# Altium schematic sheet Display_LED_Monitor.SchDoc: Display LED Monitor
size Tabloid; Date: 05/10/2023; Engineer: Terry D. Schevker; Revision: 1.0; SheetNumber: 2; SheetTotal: 2
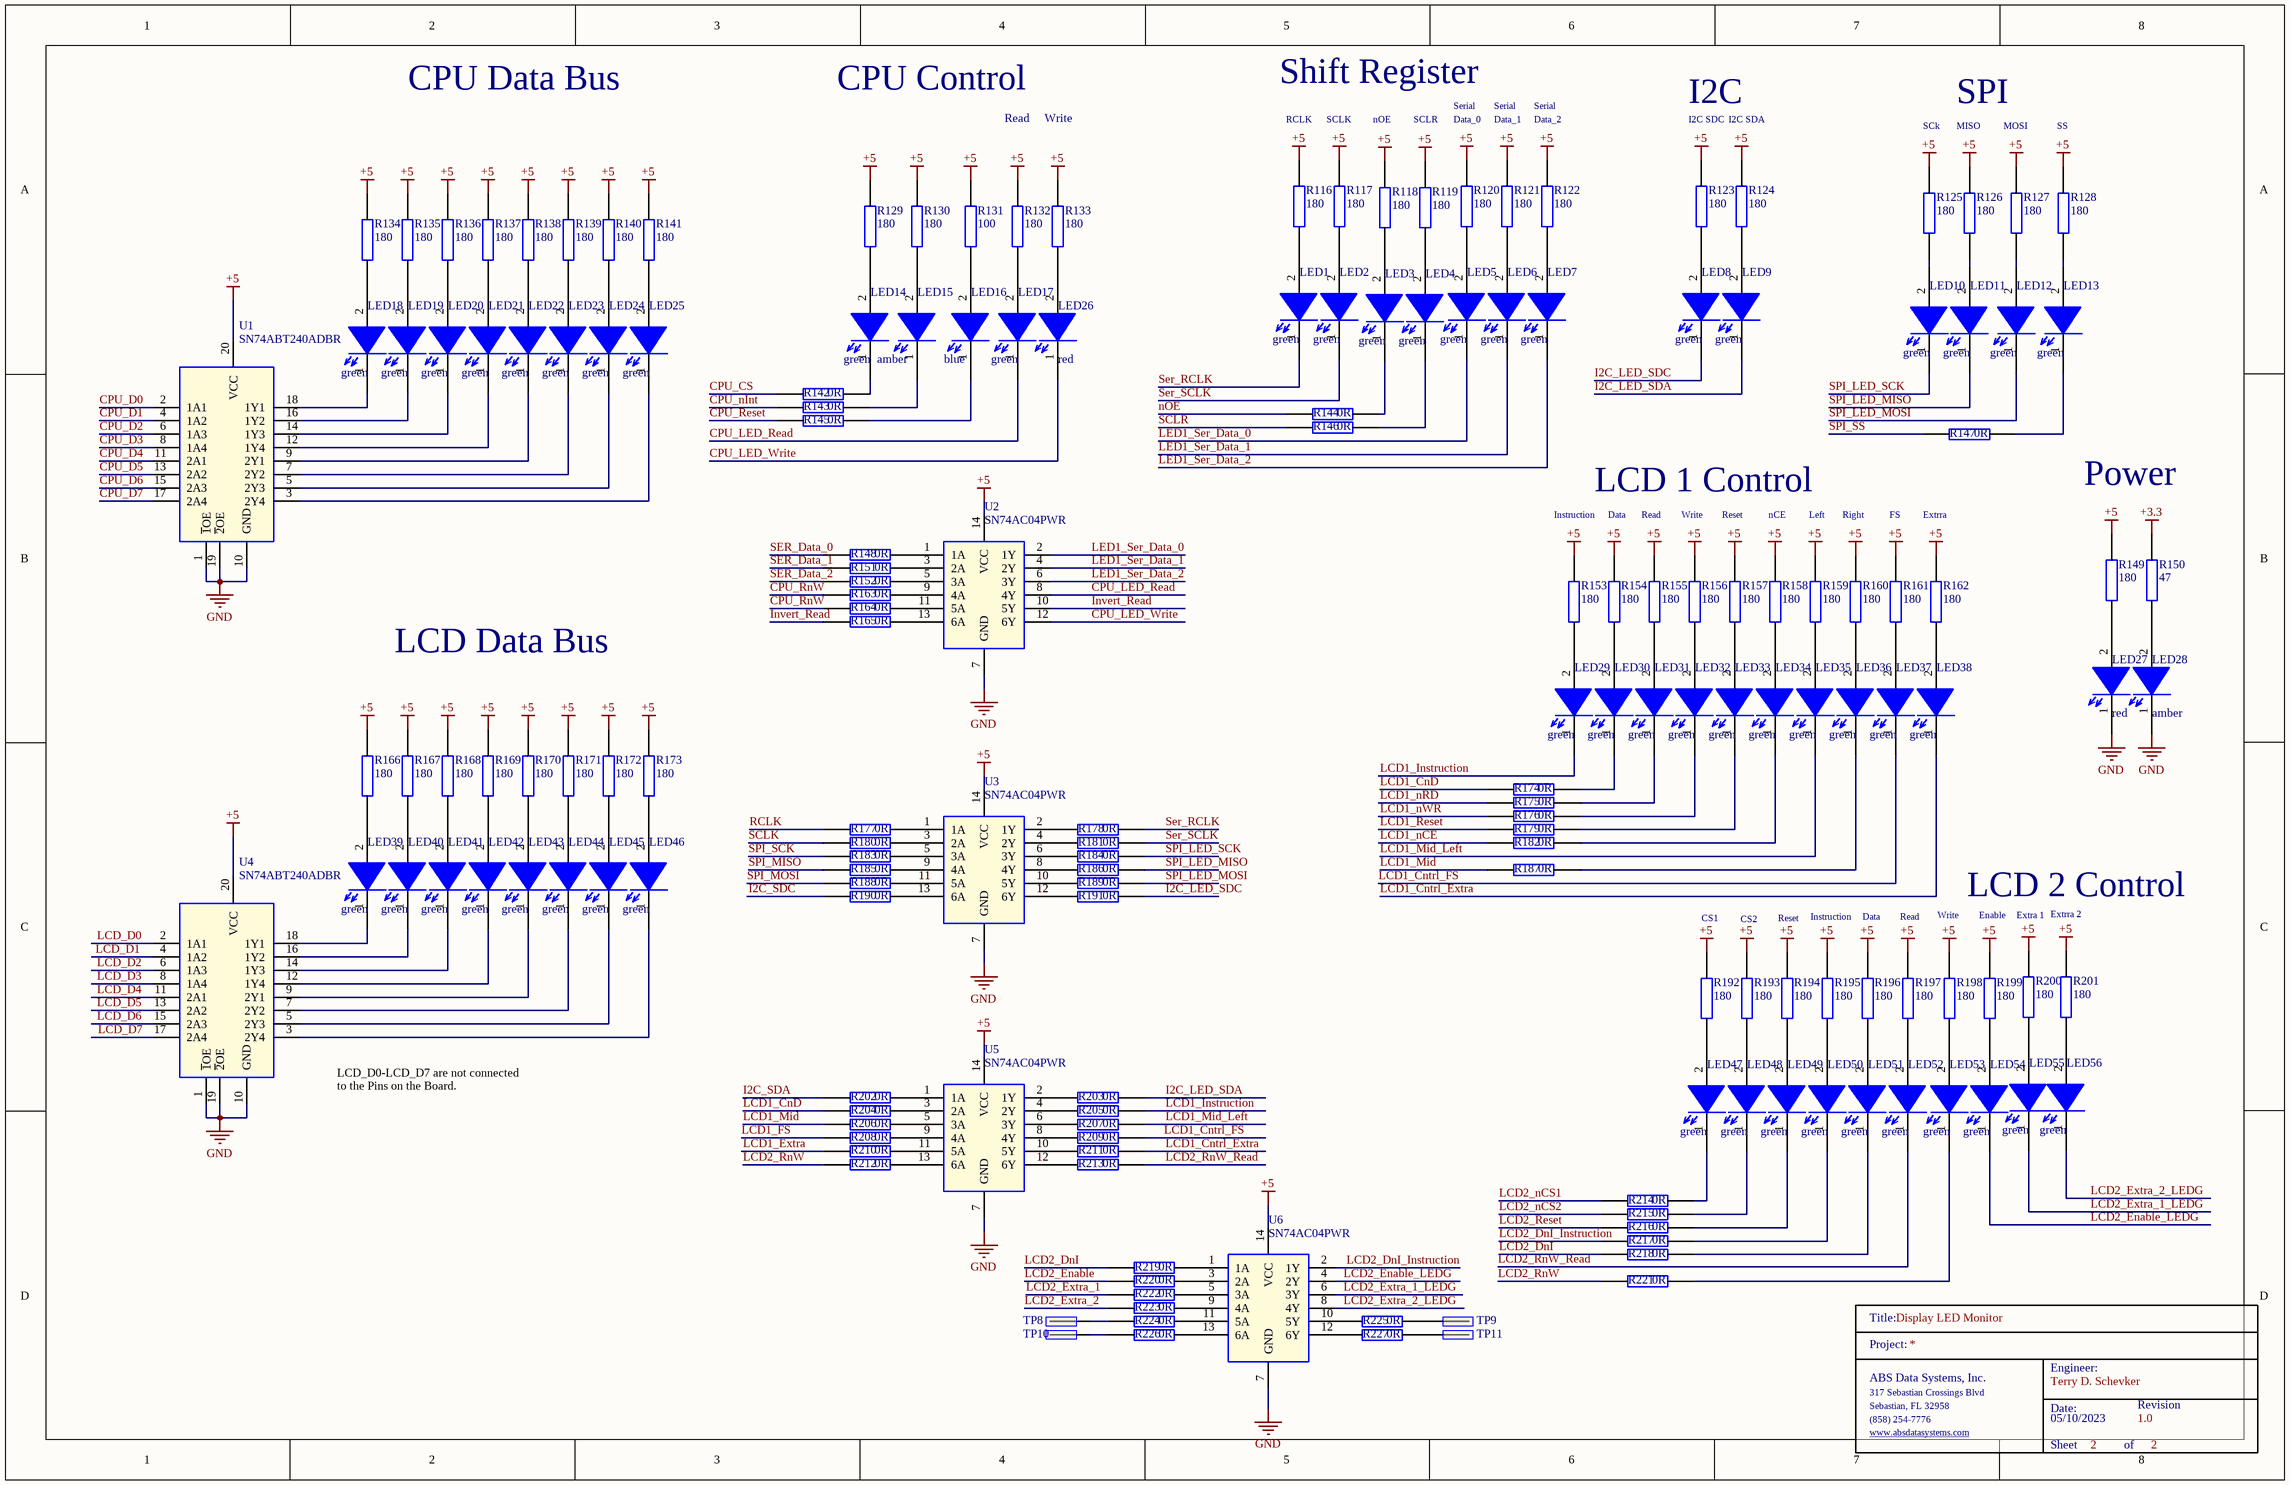
[diagram p0: Display_LED_Monitor.SchDoc]

## Parts
LED1  green  [0603_Diode]
LED2  green  [0603_Diode]
LED3  green  [0603_Diode]
LED4  green  [0603_Diode]
LED5  green  [0603_Diode]
LED6  green  [0603_Diode]
LED7  green  [0603_Diode]
LED8  green  [0603_Diode]
LED9  green  [0603_Diode]
LED10  green  [0603_Diode]
LED11  green  [0603_Diode]
LED12  green  [0603_Diode]
LED13  green  [0603_Diode]
LED14  green  [0603_Diode]
LED15  amber  [0603_Diode]
LED16  blue  [0603_Diode]
LED17  green  [0603_Diode]
LED18  green  [0603_Diode]
LED19  green  [0603_Diode]
LED20  green  [0603_Diode]
LED21  green  [0603_Diode]
LED22  green  [0603_Diode]
LED23  green  [0603_Diode]
LED24  green  [0603_Diode]
LED25  green  [0603_Diode]
LED26  red  [0603_Diode]
LED27  red  [0603_Diode]
LED28  amber  [0603_Diode]
LED29  green  [0603_Diode]
LED30  green  [0603_Diode]
LED31  green  [0603_Diode]
LED32  green  [0603_Diode]
LED33  green  [0603_Diode]
LED34  green  [0603_Diode]
LED35  green  [0603_Diode]
LED36  green  [0603_Diode]
LED37  green  [0603_Diode]
LED38  green  [0603_Diode]
LED39  green  [0603_Diode]
LED40  green  [0603_Diode]
LED41  green  [0603_Diode]
LED42  green  [0603_Diode]
LED43  green  [0603_Diode]
LED44  green  [0603_Diode]
LED45  green  [0603_Diode]
LED46  green  [0603_Diode]
LED47  green  [0603_Diode]
LED48  green  [0603_Diode]
LED49  green  [0603_Diode]
LED50  green  [0603_Diode]
LED51  green  [0603_Diode]
LED52  green  [0603_Diode]
LED53  green  [0603_Diode]
LED54  green  [0603_Diode]
LED55  green  [0603_Diode]
LED56  green  [0603_Diode]
R116  180  [0603]
R117  180  [0603]
R118  180  [0603]
R119  180  [0603]
R120  180  [0603]
R121  180  [0603]
R122  180  [0603]
R123  180  [0603]
R124  180  [0603]
R125  180  [0603]
R126  180  [0603]
R127  180  [0603]
R128  180  [0603]
R129  180  [0603]
R130  180  [0603]
R131  100  [0603]
R132  180  [0603]
R133  180  [0603]
R134  180  [0603]
R135  180  [0603]
R136  180  [0603]
R137  180  [0603]
R138  180  [0603]
R139  180  [0603]
R140  180  [0603]
R141  180  [0603]
R142  0R  [0603]
R143  0R  [0603]
R144  0R  [0603]
R145  0R  [0603]
R146  0R  [0603]
R147  0R  [0603]
R148  0R  [0603]
R149  180  [0603]
R150  47  [0603]
R151  0R  [0603]
R152  0R  [0603]
R153  180  [0603]
R154  180  [0603]
R155  180  [0603]
R156  180  [0603]
R157  180  [0603]
R158  180  [0603]
R159  180  [0603]
R160  180  [0603]
R161  180  [0603]
R162  180  [0603]
R163  0R  [0603]
R164  0R  [0603]
R165  0R  [0603]
R166  180  [0603]
R167  180  [0603]
R168  180  [0603]
R169  180  [0603]
R170  180  [0603]
R171  180  [0603]
R172  180  [0603]
R173  180  [0603]
R174  0R  [0603]
R175  0R  [0603]
R176  0R  [0603]
R177  0R  [0603]
R178  0R  [0603]
R179  0R  [0603]
R180  0R  [0603]
R181  0R  [0603]
R182  0R  [0603]
R183  0R  [0603]
R184  0R  [0603]
R185  0R  [0603]
R186  0R  [0603]
R187  0R  [0603]
R188  0R  [0603]
R189  0R  [0603]
R190  0R  [0603]
R191  0R  [0603]
R192  180  [0603]
R193  180  [0603]
R194  180  [0603]
R195  180  [0603]
R196  180  [0603]
R197  180  [0603]
R198  180  [0603]
R199  180  [0603]
R200  180  [0603]
R201  180  [0603]
R202  0R  [0603]
R203  0R  [0603]
R204  0R  [0603]
R205  0R  [0603]
R206  0R  [0603]
R207  0R  [0603]
R208  0R  [0603]
R209  0R  [0603]
R210  0R  [0603]
R211  0R  [0603]
R212  0R  [0603]
R213  0R  [0603]
R214  0R  [0603]
R215  0R  [0603]
R216  0R  [0603]
R217  0R  [0603]
R218  0R  [0603]
R219  0R  [0603]
R220  0R  [0603]
R221  0R  [0603]
R222  0R  [0603]
R223  0R  [0603]
R224  0R  [0603]
R225  0R  [0603]
R226  0R  [0603]
R227  0R  [0603]
TitleBlock_2  TitleBlock  (value not drawn)  (graphical)
TP8  TP  [TP]  (value not drawn)
TP9  TP  [TP]  (value not drawn)
TP10  TP  [TP]  (value not drawn)
TP11  TP  [TP]  (value not drawn)
U1  SN74ABT240ADBR  [SOP65P780X200-20N]
U2  SN74AC04PWR  [SOP65P640X120-14N]
U3  SN74AC04PWR  [SOP65P640X120-14N]
U4  SN74ABT240ADBR  [SOP65P780X200-20N]
U5  SN74AC04PWR  [SOP65P640X120-14N]
U6  SN74AC04PWR  [SOP65P640X120-14N]

## Nets
+3.3: R150.1
+5: R116.2 R117.2 R118.2 R119.2 R120.2 R121.2 R122.2 R123.2 R124.2 R125.2 R126.2 R127.2 R128.2 R129.2 R130.2 R131.1 R132.2 R133.2 R134.2 R135.2 R136.2 R137.2 R138.2 R139.2 R140.2 R141.2 R149.2 R153.2 R154.2 R155.2 R156.2 R157.2 R158.2 R159.2 R160.2 R161.2 R162.2 R166.2 R167.2 R168.2 R169.2 R170.2 R171.2 R172.2 R173.2 R192.2 R193.2 R194.2 R195.2 R196.2 R197.2 R198.2 R199.2 R200.2 R201.2 U1.20(VCC) U2.14(VCC) U3.14(VCC) U4.20(VCC) U5.14(VCC) U6.14(VCC)
GND: LED27.1(K) LED28.1(K) U1.1(~{1}OE) U1.10(GND) U1.19(~{2}OE) U2.7(GND) U3.7(GND) U4.1(~{1}OE) U4.10(GND) U4.19(~{2}OE) U5.7(GND) U6.7(GND)
CPU_CS: R142.1
CPU_D0: U1.2(1A1)
CPU_D1: U1.4(1A2)
CPU_D2: U1.6(1A3)
CPU_D3: U1.8(1A4)
CPU_D4: U1.11(2A1)
CPU_D5: U1.13(2A2)
CPU_D6: U1.15(2A3)
CPU_D7: U1.17(2A4)
CPU_LED_Read: LED17.1(K) U2.8(4Y)
CPU_LED_Write: LED26.1(K) U2.12(6Y)
CPU_nInt: R143.1
CPU_Reset: R145.1
CPU_RnW: R163.1 R164.1
I2C_LED_SDA: LED9.1(K) R203.2
I2C_LED_SDC: LED8.1(K) R191.2
I2C_SDA: R202.1
I2C_SDC: R190.1
Invert_Read: R165.1 U2.10(5Y)
LCD1_CnD: R174.1 R204.1
LCD1_Cntrl_Extra: LED38.1(K) R211.2
LCD1_Cntrl_FS: LED37.1(K) R209.2
LCD1_Extra: R210.1
LCD1_FS: R208.1
LCD1_Instruction: LED29.1(K) R205.2
LCD1_Mid: R187.1 R206.1
LCD1_Mid_Left: LED35.1(K) R207.2
LCD1_nCE: R182.1
LCD1_nRD: R175.1
LCD1_nWR: R176.1
LCD1_Reset: R179.1
LCD2_DnI: R218.1 R219.1
LCD2_DnI_Instruction: R217.1 U6.2(1Y)
LCD2_Enable: R220.1
LCD2_Enable_LEDG: LED54.1(K) U6.4(2Y)
LCD2_Extra_1: R222.1
LCD2_Extra_1_LEDG: LED55.1(K) U6.6(3Y)
LCD2_Extra_2: R223.1
LCD2_Extra_2_LEDG: LED56.1(K) U6.8(4Y)
LCD2_nCS1: R214.1
LCD2_nCS2: R215.1
LCD2_Reset: R216.1
LCD2_RnW: R212.1 R221.1
LCD2_RnW_Read: LED52.1(K) R213.2
LCD_D0: U4.2(1A1)
LCD_D1: U4.4(1A2)
LCD_D2: U4.6(1A3)
LCD_D3: U4.8(1A4)
LCD_D4: U4.11(2A1)
LCD_D5: U4.13(2A2)
LCD_D6: U4.15(2A3)
LCD_D7: U4.17(2A4)
LED1_Ser_Data_0: LED5.1(K) U2.2(1Y)
LED1_Ser_Data_1: LED6.1(K) U2.4(2Y)
LED1_Ser_Data_2: LED7.1(K) U2.6(3Y)
nOE: R144.1
RCLK: R177.1
SCLK: R180.1
SCLR: R146.1
SER_Data_0: R148.1
SER_Data_1: R151.1
SER_Data_2: R152.1
Ser_RCLK: LED1.1(K) R178.2
Ser_SCLK: LED2.1(K) R181.2
SPI_LED_MISO: LED11.1(K) R186.2
SPI_LED_MOSI: LED12.1(K) R189.2
SPI_LED_SCK: LED10.1(K) R184.2
SPI_MISO: R185.1
SPI_MOSI: R188.1
SPI_SCK: R183.1
SPI_SS: R147.1
NetLED1_2: LED1.2(A) R116.1
NetLED2_2: LED2.2(A) R117.1
NetLED3_1: LED3.1(K) R144.2
NetLED3_2: LED3.2(A) R118.1
NetLED4_1: LED4.1(K) R146.2
NetLED4_2: LED4.2(A) R119.1
NetLED5_2: LED5.2(A) R120.1
NetLED6_2: LED6.2(A) R121.1
NetLED7_2: LED7.2(A) R122.1
NetLED8_2: LED8.2(A) R123.1
NetLED9_2: LED9.2(A) R124.1
NetLED10_2: LED10.2(A) R125.1
NetLED11_2: LED11.2(A) R126.1
NetLED12_2: LED12.2(A) R127.1
NetLED13_1: LED13.1(K) R147.2
NetLED13_2: LED13.2(A) R128.1
NetLED14_1: LED14.1(K) R142.2
NetLED14_2: LED14.2(A) R129.1
NetLED15_1: LED15.1(K) R143.2
NetLED15_2: LED15.2(A) R130.1
NetLED16_1: LED16.1(K) R145.2
NetLED16_2: LED16.2(A) R131.2
NetLED17_2: LED17.2(A) R132.1
NetLED18_1: LED18.1(K) U1.18(1Y1)
NetLED18_2: LED18.2(A) R134.1
NetLED19_1: LED19.1(K) U1.16(1Y2)
NetLED19_2: LED19.2(A) R135.1
NetLED20_1: LED20.1(K) U1.14(1Y3)
NetLED20_2: LED20.2(A) R136.1
NetLED21_1: LED21.1(K) U1.12(1Y4)
NetLED21_2: LED21.2(A) R137.1
NetLED22_1: LED22.1(K) U1.9(2Y1)
NetLED22_2: LED22.2(A) R138.1
NetLED23_1: LED23.1(K) U1.7(2Y2)
NetLED23_2: LED23.2(A) R139.1
NetLED24_1: LED24.1(K) U1.5(2Y3)
NetLED24_2: LED24.2(A) R140.1
NetLED25_1: LED25.1(K) U1.3(2Y4)
NetLED25_2: LED25.2(A) R141.1
NetLED26_2: LED26.2(A) R133.1
NetLED27_2: LED27.2(A) R149.1
NetLED28_2: LED28.2(A) R150.2
NetLED29_2: LED29.2(A) R153.1
NetLED30_1: LED30.1(K) R174.2
NetLED30_2: LED30.2(A) R154.1
NetLED31_1: LED31.1(K) R175.2
NetLED31_2: LED31.2(A) R155.1
NetLED32_1: LED32.1(K) R176.2
NetLED32_2: LED32.2(A) R156.1
NetLED33_1: LED33.1(K) R179.2
NetLED33_2: LED33.2(A) R157.1
NetLED34_1: LED34.1(K) R182.2
NetLED34_2: LED34.2(A) R158.1
NetLED35_2: LED35.2(A) R159.1
NetLED36_1: LED36.1(K) R187.2
NetLED36_2: LED36.2(A) R160.1
NetLED37_2: LED37.2(A) R161.1
NetLED38_2: LED38.2(A) R162.1
NetLED39_1: LED39.1(K) U4.18(1Y1)
NetLED39_2: LED39.2(A) R166.1
NetLED40_1: LED40.1(K) U4.16(1Y2)
NetLED40_2: LED40.2(A) R167.1
NetLED41_1: LED41.1(K) U4.14(1Y3)
NetLED41_2: LED41.2(A) R168.1
NetLED42_1: LED42.1(K) U4.12(1Y4)
NetLED42_2: LED42.2(A) R169.1
NetLED43_1: LED43.1(K) U4.9(2Y1)
NetLED43_2: LED43.2(A) R170.1
NetLED44_1: LED44.1(K) U4.7(2Y2)
NetLED44_2: LED44.2(A) R171.1
NetLED45_1: LED45.1(K) U4.5(2Y3)
NetLED45_2: LED45.2(A) R172.1
NetLED46_1: LED46.1(K) U4.3(2Y4)
NetLED46_2: LED46.2(A) R173.1
NetLED47_1: LED47.1(K) R214.2
NetLED47_2: LED47.2(A) R192.1
NetLED48_1: LED48.1(K) R215.2
NetLED48_2: LED48.2(A) R193.1
NetLED49_1: LED49.1(K) R216.2
NetLED49_2: LED49.2(A) R194.1
NetLED50_1: LED50.1(K) R217.2
NetLED50_2: LED50.2(A) R195.1
NetLED51_1: LED51.1(K) R218.2
NetLED51_2: LED51.2(A) R196.1
NetLED52_2: LED52.2(A) R197.1
NetLED53_1: LED53.1(K) R221.2
NetLED53_2: LED53.2(A) R198.1
NetLED54_2: LED54.2(A) R199.1
NetLED55_2: LED55.2(A) R200.1
NetLED56_2: LED56.2(A) R201.1
NetR148_2: R148.2 U2.1(1A)
NetR151_2: R151.2 U2.3(2A)
NetR152_2: R152.2 U2.5(3A)
NetR163_2: R163.2 U2.9(4A)
NetR164_2: R164.2 U2.11(5A)
NetR165_2: R165.2 U2.13(6A)
NetR177_2: R177.2 U3.1(1A)
NetR178_1: R178.1 U3.2(1Y)
NetR180_2: R180.2 U3.3(2A)
NetR181_1: R181.1 U3.4(2Y)
NetR183_2: R183.2 U3.5(3A)
NetR184_1: R184.1 U3.6(3Y)
NetR185_2: R185.2 U3.9(4A)
NetR186_1: R186.1 U3.8(4Y)
NetR188_2: R188.2 U3.11(5A)
NetR189_1: R189.1 U3.10(5Y)
NetR190_2: R190.2 U3.13(6A)
NetR191_1: R191.1 U3.12(6Y)
NetR202_2: R202.2 U5.1(1A)
NetR203_1: R203.1 U5.2(1Y)
NetR204_2: R204.2 U5.3(2A)
NetR205_1: R205.1 U5.4(2Y)
NetR206_2: R206.2 U5.5(3A)
NetR207_1: R207.1 U5.6(3Y)
NetR208_2: R208.2 U5.9(4A)
NetR209_1: R209.1 U5.8(4Y)
NetR210_2: R210.2 U5.11(5A)
NetR211_1: R211.1 U5.10(5Y)
NetR212_2: R212.2 U5.13(6A)
NetR213_1: R213.1 U5.12(6Y)
NetR219_2: R219.2 U6.1(1A)
NetR220_2: R220.2 U6.3(2A)
NetR222_2: R222.2 U6.5(3A)
NetR223_2: R223.2 U6.9(4A)
NetR224_1: R224.1 TP8.1
NetR224_2: R224.2 U6.11(5A)
NetR225_1: R225.1 U6.10(5Y)
NetR225_2: R225.2 TP9.1
NetR226_1: R226.1 TP10.1
NetR226_2: R226.2 U6.13(6A)
NetR227_1: R227.1 U6.12(6Y)
NetR227_2: R227.2 TP11.1

## Notes on the sheet
- CPU Data Bus
- CPU Control
- Shift Register
- Read
- Write
- RCLK
- SCLK
- nOE
- SCLR
- Data_0
- Serial
- Data_1
- Data_2
- I2C
- I2C SDC
- I2C SDA
- SCk
- SPI
- MISO
- MOSI
- SS
- LCD 1 Control
- Power
- Instruction
- Data
- Reset
- nCE
- Left
- Right
- FS
- Extrra
- LCD Data Bus
- LCD 2 Control
- CS1
- CS2
- Enable
- Extra 1
- Extrra 2
- LCD_D0-LCD_D7 are not connected to the Pins on the Board.
- (in symbol TitleBlock) Title:; Project:; Engineer:; ABS Data Systems, Inc.; 317 Sebastian Crossings Blvd; Sebastian, FL 32958; Date:; Revision; (858) 254-7776; www.absdatasystems.com; Sheet; of

## Library data of the parts
LED1-LED14 LED17-LED25 LED29-LED56 = 150060GS75000: Wurth Elektronik 0603 green; Manufacturer: Wurth Electronics; Wavelength: 520nm; Viewing Angle: 140°; Lens Style: Clear,Rectangular; Luminous Intensity: 430mcd; Forward Current: 30mA; Forward Voltage: 3.2V; Test Current: 20mA; Supplier 1: Digi-Key; Manufacturer Part Number: 150060GS75000; RoHS: Yes; Category: LEDs; Stock 1: 71509; Pricing 1: 1=0.14000, 50=0.13300, 100=0.11400, 500=0.09900 (USD); Mount: Surface Mount; Case/Package: 0603; Color: Green; Case Code (Metric): 1608; Case Code (Imperial): 0603; Min Operating Temperature: -40°C; Max Operating Temperature: 85°C; Package Quantity: 4000; Packaging: Tape and Reel; Dominant Wavelength: 520nm; Length: 1.6mm; Width: 0.8mm; Height: 0.7mm; REACH SVHC: Unknown; Lead Free: Lead Free; ComponentLink1URL: https://datasheet.ciiva.com/29562/150060gs75000-29562868.pdf?src-supplier=Digi-Key; ComponentLink1Description: https://datasheet.ciiva.com/29562/150060gs75000-29562868.pdf?src-supplier=Digi-Key; ComponentLink2URL: https://datasheet.ciiva.com/29279/759427-da-01-en-chipled-0603-w-kl-gruen-150060gs75000-29279201.pdf?src-supplier=Conrad; ComponentLink2Description: https://datasheet.ciiva.com/29279/759427-da-01-en-chipled-0603-w-kl-gruen-150060gs75000-29279201.pdf?src-supplier=Conrad; ComponentLink3URL: https://datasheet.ciiva.com/29562/150060gs75000-29562869.pdf?src-supplier=Digi-Key; ComponentLink3Description: https://datasheet.ciiva.com/29562/150060gs75000-29562869.pdf?src-supplier=Digi-Key; ComponentLink4URL: https://datasheet.ciiva.com/29562/150060gs75000-29562870.pdf?src-supplier=Digi-Key; ComponentLink4Description: https://datasheet.ciiva.com/29562/150060gs75000-29562870.pdf?src-supplier=Digi-Key
LED15 LED28 = 150060AS75000: Wurth Elektronik 0603 amber; Manufacturer: Wurth Electronics; Manufacturer Part Number: 150060GS75000; Color: Green; Wavelength: 520nm; Viewing Angle: 140°; Lens Style: Clear,Rectangular; Luminous Intensity: 430mcd; Forward Current: 30mA; Forward Voltage: 3.2V; Test Current: 20mA; Supplier 1: Digi-Key; RoHS: Yes; Category: LEDs; Stock 1: 71509; Pricing 1: 1=0.14000, 50=0.13300, 100=0.11400, 500=0.09900 (USD); Mount: Surface Mount; Case/Package: 0603; Case Code (Metric): 1608; Case Code (Imperial): 0603; Min Operating Temperature: -40°C; Max Operating Temperature: 85°C; Package Quantity: 4000; Packaging: Tape and Reel; Dominant Wavelength: 520nm; Length: 1.6mm; Width: 0.8mm; Height: 0.7mm; REACH SVHC: Unknown; Lead Free: Lead Free; ComponentLink1URL: https://datasheet.ciiva.com/29562/150060gs75000-29562868.pdf?src-supplier=Digi-Key; ComponentLink1Description: https://datasheet.ciiva.com/29562/150060gs75000-29562868.pdf?src-supplier=Digi-Key; ComponentLink2URL: https://datasheet.ciiva.com/29279/759427-da-01-en-chipled-0603-w-kl-gruen-150060gs75000-29279201.pdf?src-supplier=Conrad; ComponentLink2Description: https://datasheet.ciiva.com/29279/759427-da-01-en-chipled-0603-w-kl-gruen-150060gs75000-29279201.pdf?src-supplier=Conrad; ComponentLink3URL: https://datasheet.ciiva.com/29562/150060gs75000-29562869.pdf?src-supplier=Digi-Key; ComponentLink3Description: https://datasheet.ciiva.com/29562/150060gs75000-29562869.pdf?src-supplier=Digi-Key; ComponentLink4URL: https://datasheet.ciiva.com/29562/150060gs75000-29562870.pdf?src-supplier=Digi-Key; ComponentLink4Description: https://datasheet.ciiva.com/29562/150060gs75000-29562870.pdf?src-supplier=Digi-Key
LED16 = 150060BS75000: Wurth Elektronik 0603 blue; Manufacturer: Wurth Electronics; Manufacturer Part Number: 150060GS75000; Color: Green; Wavelength: 520nm; Viewing Angle: 140°; Lens Style: Clear,Rectangular; Luminous Intensity: 430mcd; Forward Current: 30mA; Forward Voltage: 3.2V; Test Current: 20mA; Supplier 1: Digi-Key; RoHS: Yes; Category: LEDs; Stock 1: 71509; Pricing 1: 1=0.14000, 50=0.13300, 100=0.11400, 500=0.09900 (USD); Mount: Surface Mount; Case/Package: 0603; Case Code (Metric): 1608; Case Code (Imperial): 0603; Min Operating Temperature: -40°C; Max Operating Temperature: 85°C; Package Quantity: 4000; Packaging: Tape and Reel; Dominant Wavelength: 520nm; Length: 1.6mm; Width: 0.8mm; Height: 0.7mm; REACH SVHC: Unknown; Lead Free: Lead Free; ComponentLink1URL: https://datasheet.ciiva.com/29562/150060gs75000-29562868.pdf?src-supplier=Digi-Key; ComponentLink1Description: https://datasheet.ciiva.com/29562/150060gs75000-29562868.pdf?src-supplier=Digi-Key; ComponentLink2URL: https://datasheet.ciiva.com/29279/759427-da-01-en-chipled-0603-w-kl-gruen-150060gs75000-29279201.pdf?src-supplier=Conrad; ComponentLink2Description: https://datasheet.ciiva.com/29279/759427-da-01-en-chipled-0603-w-kl-gruen-150060gs75000-29279201.pdf?src-supplier=Conrad; ComponentLink3URL: https://datasheet.ciiva.com/29562/150060gs75000-29562869.pdf?src-supplier=Digi-Key; ComponentLink3Description: https://datasheet.ciiva.com/29562/150060gs75000-29562869.pdf?src-supplier=Digi-Key; ComponentLink4URL: https://datasheet.ciiva.com/29562/150060gs75000-29562870.pdf?src-supplier=Digi-Key; ComponentLink4Description: https://datasheet.ciiva.com/29562/150060gs75000-29562870.pdf?src-supplier=Digi-Key
LED26 LED27 = 150060RS75000: Wurth Elektronik 0603 red; Manufacturer: Wurth Electronics; Manufacturer Part Number: 150060GS75000; Color: Green; Wavelength: 520nm; Viewing Angle: 140°; Lens Style: Clear,Rectangular; Luminous Intensity: 430mcd; Forward Current: 30mA; Forward Voltage: 3.2V; Test Current: 20mA; Supplier 1: Digi-Key; RoHS: Yes; Category: LEDs; Stock 1: 71509; Pricing 1: 1=0.14000, 50=0.13300, 100=0.11400, 500=0.09900 (USD); Mount: Surface Mount; Case/Package: 0603; Case Code (Metric): 1608; Case Code (Imperial): 0603; Min Operating Temperature: -40°C; Max Operating Temperature: 85°C; Package Quantity: 4000; Packaging: Tape and Reel; Dominant Wavelength: 520nm; Length: 1.6mm; Width: 0.8mm; Height: 0.7mm; REACH SVHC: Unknown; Lead Free: Lead Free; ComponentLink1URL: https://datasheet.ciiva.com/29562/150060gs75000-29562868.pdf?src-supplier=Digi-Key; ComponentLink1Description: https://datasheet.ciiva.com/29562/150060gs75000-29562868.pdf?src-supplier=Digi-Key; ComponentLink2URL: https://datasheet.ciiva.com/29279/759427-da-01-en-chipled-0603-w-kl-gruen-150060gs75000-29279201.pdf?src-supplier=Conrad; ComponentLink2Description: https://datasheet.ciiva.com/29279/759427-da-01-en-chipled-0603-w-kl-gruen-150060gs75000-29279201.pdf?src-supplier=Conrad; ComponentLink3URL: https://datasheet.ciiva.com/29562/150060gs75000-29562869.pdf?src-supplier=Digi-Key; ComponentLink3Description: https://datasheet.ciiva.com/29562/150060gs75000-29562869.pdf?src-supplier=Digi-Key; ComponentLink4URL: https://datasheet.ciiva.com/29562/150060gs75000-29562870.pdf?src-supplier=Digi-Key; ComponentLink4Description: https://datasheet.ciiva.com/29562/150060gs75000-29562870.pdf?src-supplier=Digi-Key
R116-R130 R132-R141 R149 R153-R162 R166-R173 R192-R201 = RC0603FR-13180RL: YAGEO 0603 180 ohm; Manufacturer_Name: KEMET; Manufacturer_Part_Number: RC0603JR-070RL; Geometry.Height: 0.55mm; Mouser Part Number: 603-RC0603JR-070RL; Mouser Price/Stock: https://www.mouser.co.uk/ProductDetail/YAGEO/RC0603JR-070RL?qs=2cAdsCoAWRGWyPcuXgGiXQ%3D%3D; Datasheet Link: https://datasheet.datasheetarchive.com/originals/distributors/Datasheets_SAMA/902f9e387b938f871d31120f5fc1d65e.pdf
R131 = RC0603FR-10100RL: YAGEO 0603 100 ohm; Manufacturer_Name: KEMET; Manufacturer_Part_Number: RC0603JR-070RL; Geometry.Height: 0.55mm; Mouser Part Number: 603-RC0603JR-070RL; Mouser Price/Stock: https://www.mouser.co.uk/ProductDetail/YAGEO/RC0603JR-070RL?qs=2cAdsCoAWRGWyPcuXgGiXQ%3D%3D; Datasheet Link: https://datasheet.datasheetarchive.com/originals/distributors/Datasheets_SAMA/902f9e387b938f871d31120f5fc1d65e.pdf
R142-R148 R151 R152 R163-R165 R174-R191 R202-R227 = RC0603JR-070RL: YAGEO 0603 0 ohm; Manufacturer_Name: KEMET; Geometry.Height: 0.55mm; Mouser Part Number: 603-RC0603JR-070RL; Mouser Price/Stock: https://www.mouser.co.uk/ProductDetail/YAGEO/RC0603JR-070RL?qs=2cAdsCoAWRGWyPcuXgGiXQ%3D%3D; Manufacturer_Part_Number: RC0603JR-070RL; Datasheet Link: https://datasheet.datasheetarchive.com/originals/distributors/Datasheets_SAMA/902f9e387b938f871d31120f5fc1d65e.pdf
R150 = RC0603FR-0747KL: YAGEO 0603 47; Manufacturer_Name: KEMET; Manufacturer_Part_Number: RC0603JR-070RL; Geometry.Height: 0.55mm; Mouser Part Number: 603-RC0603JR-070RL; Mouser Price/Stock: https://www.mouser.co.uk/ProductDetail/YAGEO/RC0603JR-070RL?qs=2cAdsCoAWRGWyPcuXgGiXQ%3D%3D; Datasheet Link: https://datasheet.datasheetarchive.com/originals/distributors/Datasheets_SAMA/902f9e387b938f871d31120f5fc1d65e.pdf
TP8-TP11 = TP: Manufacturer: Samtec; Manufacturer Part Number: TST-105-01-G-D; Number of Contacts: 16; Gender: Male; Connector Type: Male Pin; Pitch: 2.54mm; Row Spacing: 0.1inch; Supplier 1: Digi-Key; RoHS: Yes; Category: Headers and Wire Housings; Stock 1: 227; Pricing 1: 1=2.85000, 10=2.73600, 100=2.28000, 500=1.93800, 1000=1.65300, 5000=1.48200 (USD); Mount: Through Hole; Contact Plating: Gold; Contact Material: Bronze; Housing Material: Polyester; Housing Color: Black; Color: Black; Min Operating Temperature: -55°C; Max Operating Temperature: 125°C; Number of Rows: 2; Termination: Solder; Packaging: Rail/Tube; Orientation: Straight; Number of Positions: 16; Length: 27.94mm; Depth: 9.27mm; Contact Mating Length: 0.25inch; REACH SVHC: No SVHC; ComponentLink1URL: https://datasheet.ciiva.com/739/tst-mkt-739845.pdf?src-supplier=Digi-Key; ComponentLink1Description: https://datasheet.ciiva.com/739/tst-mkt-739845.pdf?src-supplier=Digi-Key; ComponentLink2URL: https://datasheet.ciiva.com/10018/htst-10018510.pdf?src-supplier=Avnet; ComponentLink2Description: https://datasheet.ciiva.com/10018/htst-10018510.pdf?src-supplier=Avnet
U1 U4 = SN74ABT240ADBR: Octal Buffers/Drivers With 3-State Outputs; Manufacturer_Name: Texas Instruments; Geometry.Height: 2mm; Mouser Part Number: 595-SN74ABT240ADBR; Mouser Price/Stock: https://www.mouser.co.uk/ProductDetail/Texas-Instruments/SN74ABT240ADBR?qs=JHHQeKcAU3Dt82k%252BVyiYdw%3D%3D; Manufacturer_Part_Number: SN74ABT240ADBR; Datasheet Link: http://www.ti.com/lit/gpn/sn74abt240a
U2 U3 U5 U6 = SN74AC04PWR: Hex Inverters; Manufacturer_Name: Texas Instruments; Geometry.Height: 1.2mm; Mouser Part Number: 595-SN74AC04PWR; Mouser Price/Stock: https://www.mouser.co.uk/ProductDetail/Texas-Instruments/SN74AC04PWR?qs=RZS%252BpEsUn7pRvPNqsga4SA%3D%3D; Manufacturer_Part_Number: SN74AC04PWR; Datasheet Link: http://www.ti.com/lit/gpn/sn74ac04